# Altium project Project_Ontwerpen.PrjPcb
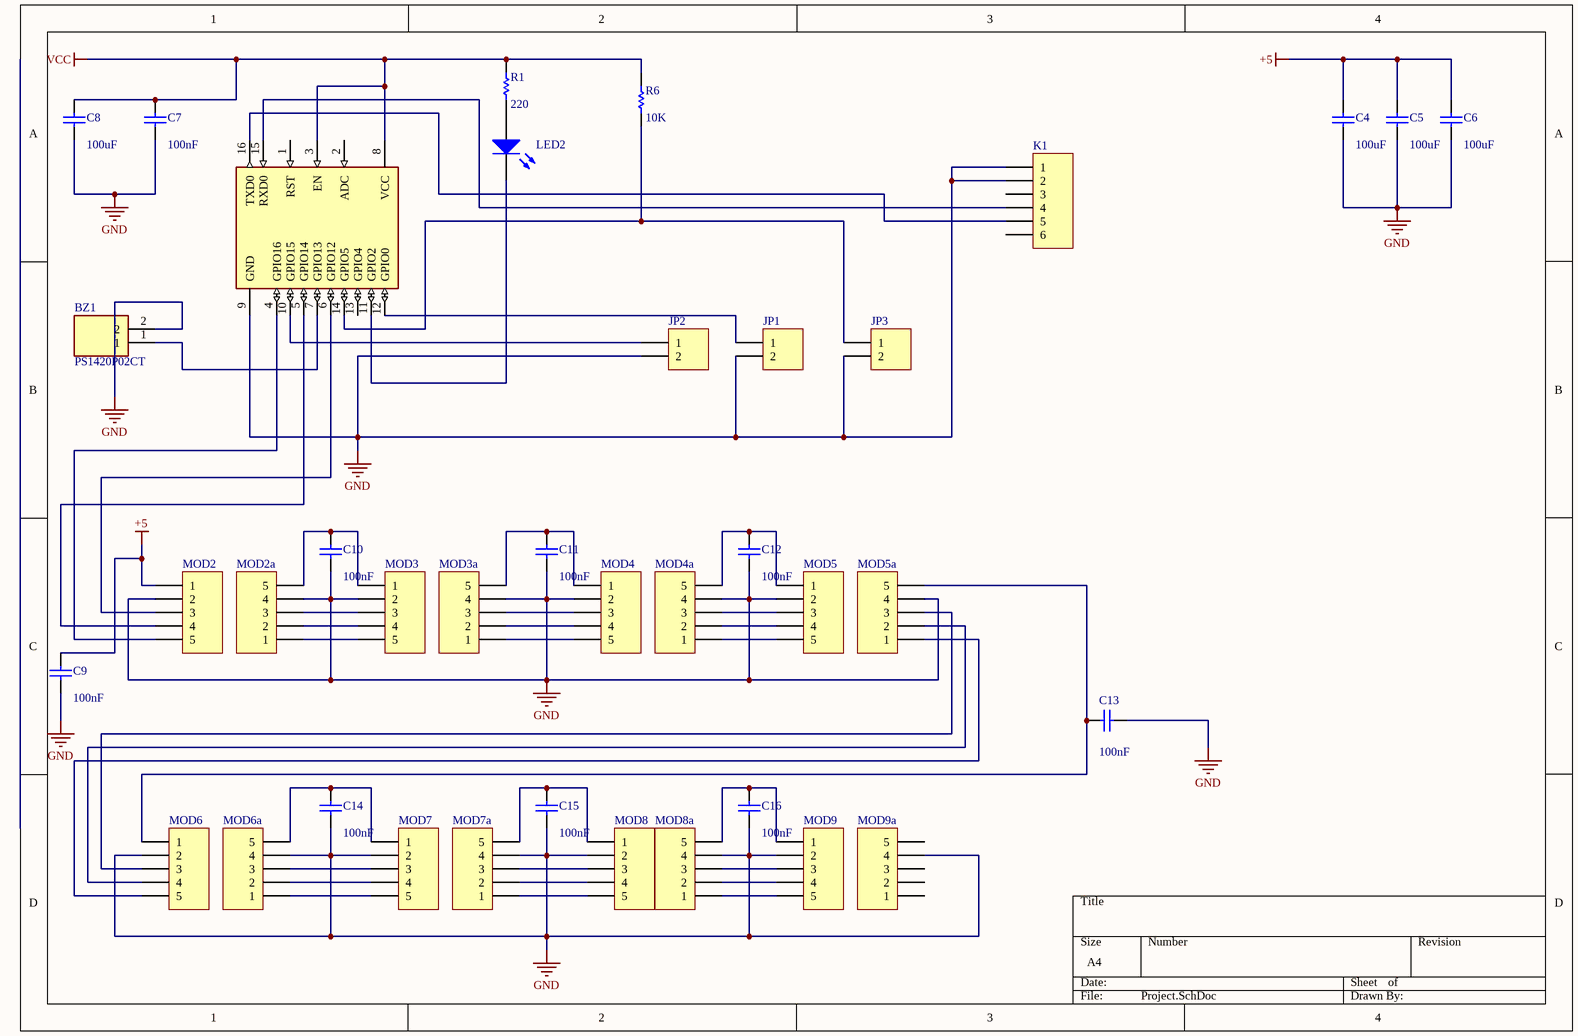
[diagram p0: Project.SchDoc]
1 sheet, 38 parts. Net scope: global (net labels, ports and power ports of the same name join across sheets).
Board file: PCB1.PcbDoc

## Sheet Project.SchDoc
size A4; SheetNumber: 1; SheetTotal: 2

### Parts
BZ1  PS1420P02CT  [PS1440P02BT]
C4  value 100uF  [CAP_EEV-FK1K101V]  (hidden comment: Cap)
C5  value 100uF  [CAP_EEV-FK1K101V]  (hidden comment: Cap)
C6  value 100uF  [CAP_EEV-FK1K101V]  (hidden comment: Cap)
C7  value 100nF  [6-0805_M]  (hidden comment: Cap)
C8  value 100uF  [CAP_EEV-FK1K101V]
C9  value 100nF  [6-0805_M]  (hidden comment: Cap)
C10  value 100nF  [6-0805_M]  (hidden comment: Cap)
C11  value 100nF  [6-0805_M]  (hidden comment: Cap)
C12  value 100nF  [6-0805_M]  (hidden comment: Cap)
C13  value 100nF  [6-0805_M]  (hidden comment: Cap)
C14  value 100nF  [6-0805_M]  (hidden comment: Cap)
C15  value 100nF  [6-0805_M]  (hidden comment: Cap)
C16  value 100nF  [6-0805_M]  (hidden comment: Cap)
JP1  Header 2  [HDR1X2]  (value not drawn)
JP2  Header 2  [HDR1X2]  (value not drawn)
JP3  Header 2  [HDR1X2]  (value not drawn)
K1  Header 6  [HDR1X6]  (value not drawn)
LED2  LED0  [LED-0]  (value not drawn)
MOD2  Header 5  [HDR1X5]  (value not drawn)
MOD2a  Header 5  [HDR1X5]  (value not drawn)
MOD3  Header 5  [HDR1X5]  (value not drawn)
MOD3a  Header 5  [HDR1X5]  (value not drawn)
MOD4  Header 5  [HDR1X5]  (value not drawn)
MOD4a  Header 5  [HDR1X5]  (value not drawn)
MOD5  Header 5  [HDR1X5]  (value not drawn)
MOD5a  Header 5  [HDR1X5]  (value not drawn)
MOD6  Header 5  [HDR1X5]  (value not drawn)
MOD6a  Header 5  [HDR1X5]  (value not drawn)
MOD7  Header 5  [HDR1X5]  (value not drawn)
MOD7a  Header 5  [HDR1X5]  (value not drawn)
MOD8  Header 5  [HDR1X5]  (value not drawn)
MOD8a  Header 5  [HDR1X5]  (value not drawn)
MOD9  Header 5  [HDR1X5]  (value not drawn)
MOD9a  Header 5  [HDR1X5]  (value not drawn)
R1  value 220  [6-0805_M]  (hidden comment: Res1)
R6  value 10K  [6-0805_M]  (hidden comment: Res1)
  ESP-12S  [Adafruit_Industries_ESP-12S_MFG]  (value not drawn)

### Nets
+5: C4.2 C5.2 C6.2 C9.2 MOD2.1
GND: BZ1.2 C4.1 C5.1 C6.1 C7.1 C8.1 C9.1 C10.1 C11.1 C12.1 C13.2 C14.1 C15.1 C16.1 JP1.2 JP2.2 JP3.2 K1.1 K1.2 MOD2.2 MOD2a.4 MOD3.2 MOD3a.4 MOD4.2 MOD4a.4 MOD5.2 MOD5a.4 MOD6.2 MOD6a.4 MOD7.2 MOD7a.4 MOD8.2 MOD8a.4 MOD9.2 MOD9a.4 .9(GND)
VCC: C7.2 C8.2 R1.2 R6.2 .3(EN) .8(VCC)
NetBZ1_1: BZ1.1 .7(GPIO13)
NetC10_2: C10.2 MOD2a.5 MOD3.1
NetC11_2: C11.2 MOD3a.5 MOD4.1
NetC12_2: C12.2 MOD4a.5 MOD5.1
NetC13_1: C13.1 MOD5a.5 MOD6.1
NetC14_2: C14.2 MOD6a.5 MOD7.1
NetC15_2: C15.2 MOD7a.5 MOD8.1
NetC16_2: C16.2 MOD8a.5 MOD9.1
NetJP1_1: JP1.1 .12(GPIO0)
NetJP2_1: JP2.1 .10(GPIO15)
NetJP3_1: JP3.1 R6.1 .14(GPIO5)
NetK1_4: K1.4 .15(RXD0)
NetK1_5: K1.5 .16(TXD0)
NetLED2_1: LED2.1(A) R1.1
NetLED2_2: LED2.2(K) .11(GPIO2)
NetMOD2_3: MOD2.3 .6(GPIO12)
NetMOD2_4: MOD2.4 .5(GPIO14)
NetMOD2_5: MOD2.5 .4(GPIO16)
NetMOD2a_1: MOD2a.1 MOD3.5
NetMOD2a_2: MOD2a.2 MOD3.4
NetMOD2a_3: MOD2a.3 MOD3.3
NetMOD3a_1: MOD3a.1 MOD4.5
NetMOD3a_2: MOD3a.2 MOD4.4
NetMOD3a_3: MOD3a.3 MOD4.3
NetMOD4a_1: MOD4a.1 MOD5.5
NetMOD4a_2: MOD4a.2 MOD5.4
NetMOD4a_3: MOD4a.3 MOD5.3
NetMOD5a_1: MOD5a.1 MOD6.5
NetMOD5a_2: MOD5a.2 MOD6.4
NetMOD5a_3: MOD5a.3 MOD6.3
NetMOD6a_1: MOD6a.1 MOD7.5
NetMOD6a_2: MOD6a.2 MOD7.4
NetMOD6a_3: MOD6a.3 MOD7.3
NetMOD7a_1: MOD7a.1 MOD8.5
NetMOD7a_2: MOD7a.2 MOD8.4
NetMOD7a_3: MOD7a.3 MOD8.3
NetMOD8a_1: MOD8a.1 MOD9.5
NetMOD8a_2: MOD8a.2 MOD9.4
NetMOD8a_3: MOD8a.3 MOD9.3

Not connected (* = marked no-connect by the designer): K1 3 6; MOD9a 1 2 3 5;  1(RST) 2(ADC) 13(GPIO4)

### Library data of the parts
BZ1 = PS1420P02CT: Loudspeaker or Buzzer; Manufacturer_Name: TDK; Datasheet Link: https://product.tdk.com/info/en/catalog/datasheets/piezoelectronic_buzzer_ps_en.pdf; Manufacturer_Part_Number: PS1420P02CT; Mouser Part Number: 810-PS1420P02CT; Mouser Price/Stock: https://www.mouser.co.uk/ProductDetail/TDK/PS1420P02CT/?qs=%2FYUS%2FYztVmCoyuykscZK%252Bw%3D%3D; Arrow Part Number: PS1420P02CT; Arrow Price/Stock: https://www.arrow.com/en/products/ps1420p02ct/tdk
C4-C16 = Cap: Capacitor; Published: 8-Jun-2000; LatestRevisionDate: 17-Jul-2002; LatestRevisionNote: Re-released for DXP Platform.; PackageReference: RAD-0.3; Publisher: Altium Limited; PackageDescription: Radial Cap, Thru-Hole; 2 Leads; 0.3 in Pin Spacing
JP1-JP3 = Header 2: Header, 2-Pin; LatestRevisionDate: 17-Jul-2002; LatestRevisionNote: Re-released for DXP Platform.; Publisher: Altium Limited
K1 = Header 6: Header, 6-Pin; LatestRevisionDate: 17-Jul-2002; LatestRevisionNote: Re-released for DXP Platform.; Publisher: Altium Limited
LED2 = LED0: Typical INFRARED GaAs LED; Published: 8-Jun-2000; LatestRevisionDate: 08-Jul-2005; LatestRevisionNote: Mech Layer 1 removed.; PackageReference: LED-0; Publisher: Altium Limited; PackageDescription: LED; 2 Leads
MOD2 MOD2a MOD3 MOD3a MOD4 MOD4a MOD5 MOD5a MOD6 MOD6a MOD7 MOD7a MOD8 MOD8a MOD9 MOD9a = Header 5: Header, 5-Pin; LatestRevisionDate: 17-Jul-2002; LatestRevisionNote: Re-released for DXP Platform.; Publisher: Altium Limited
R1 R6 = Res1: Resistor; Published: 8-Jun-2000; LatestRevisionDate: 17-Jul-2002; LatestRevisionNote: Re-released for DXP Platform.; PackageReference: AXIAL-0.3; Publisher: Altium Limited; PackageDescription: Axial Device, Thru-Hole; 2 Leads; 0.3 in Pin Spacing